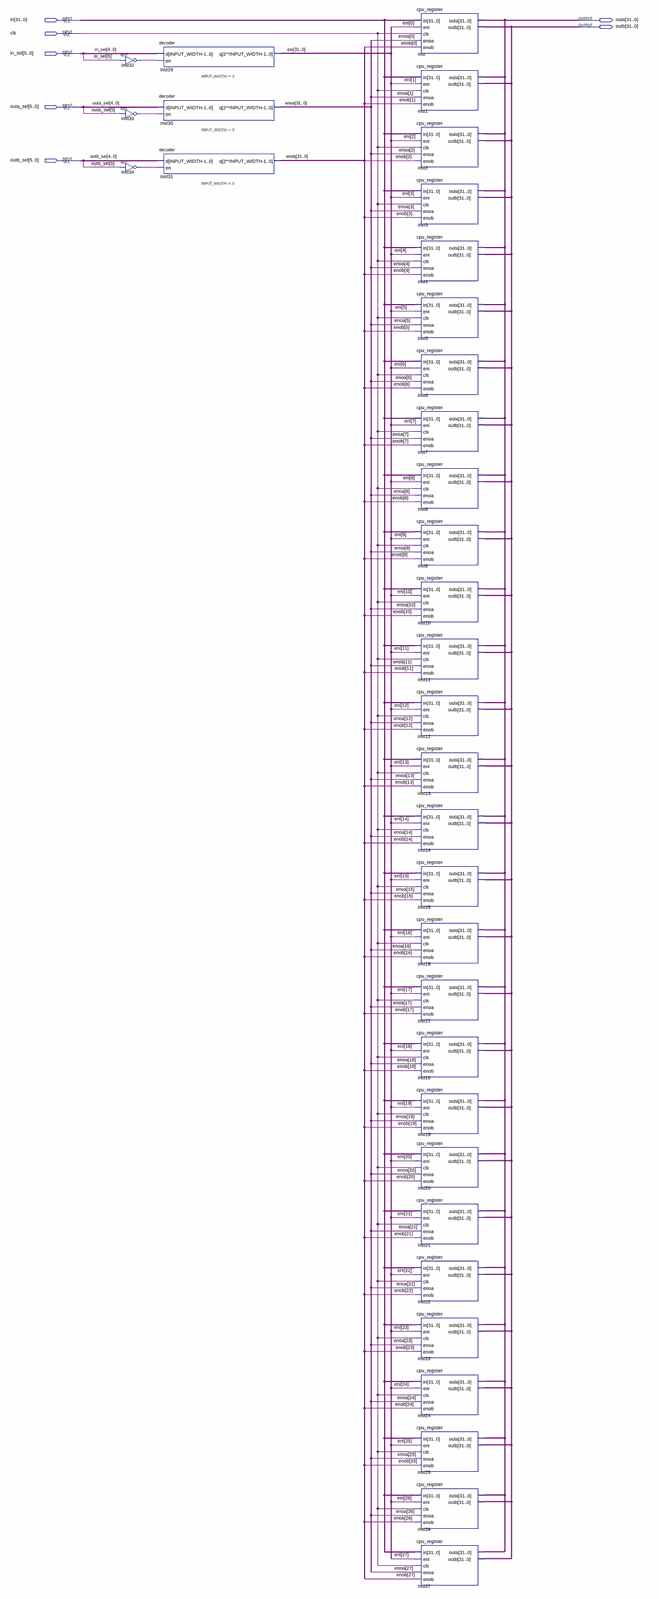
[diagram p0: schematic sheet, whole]
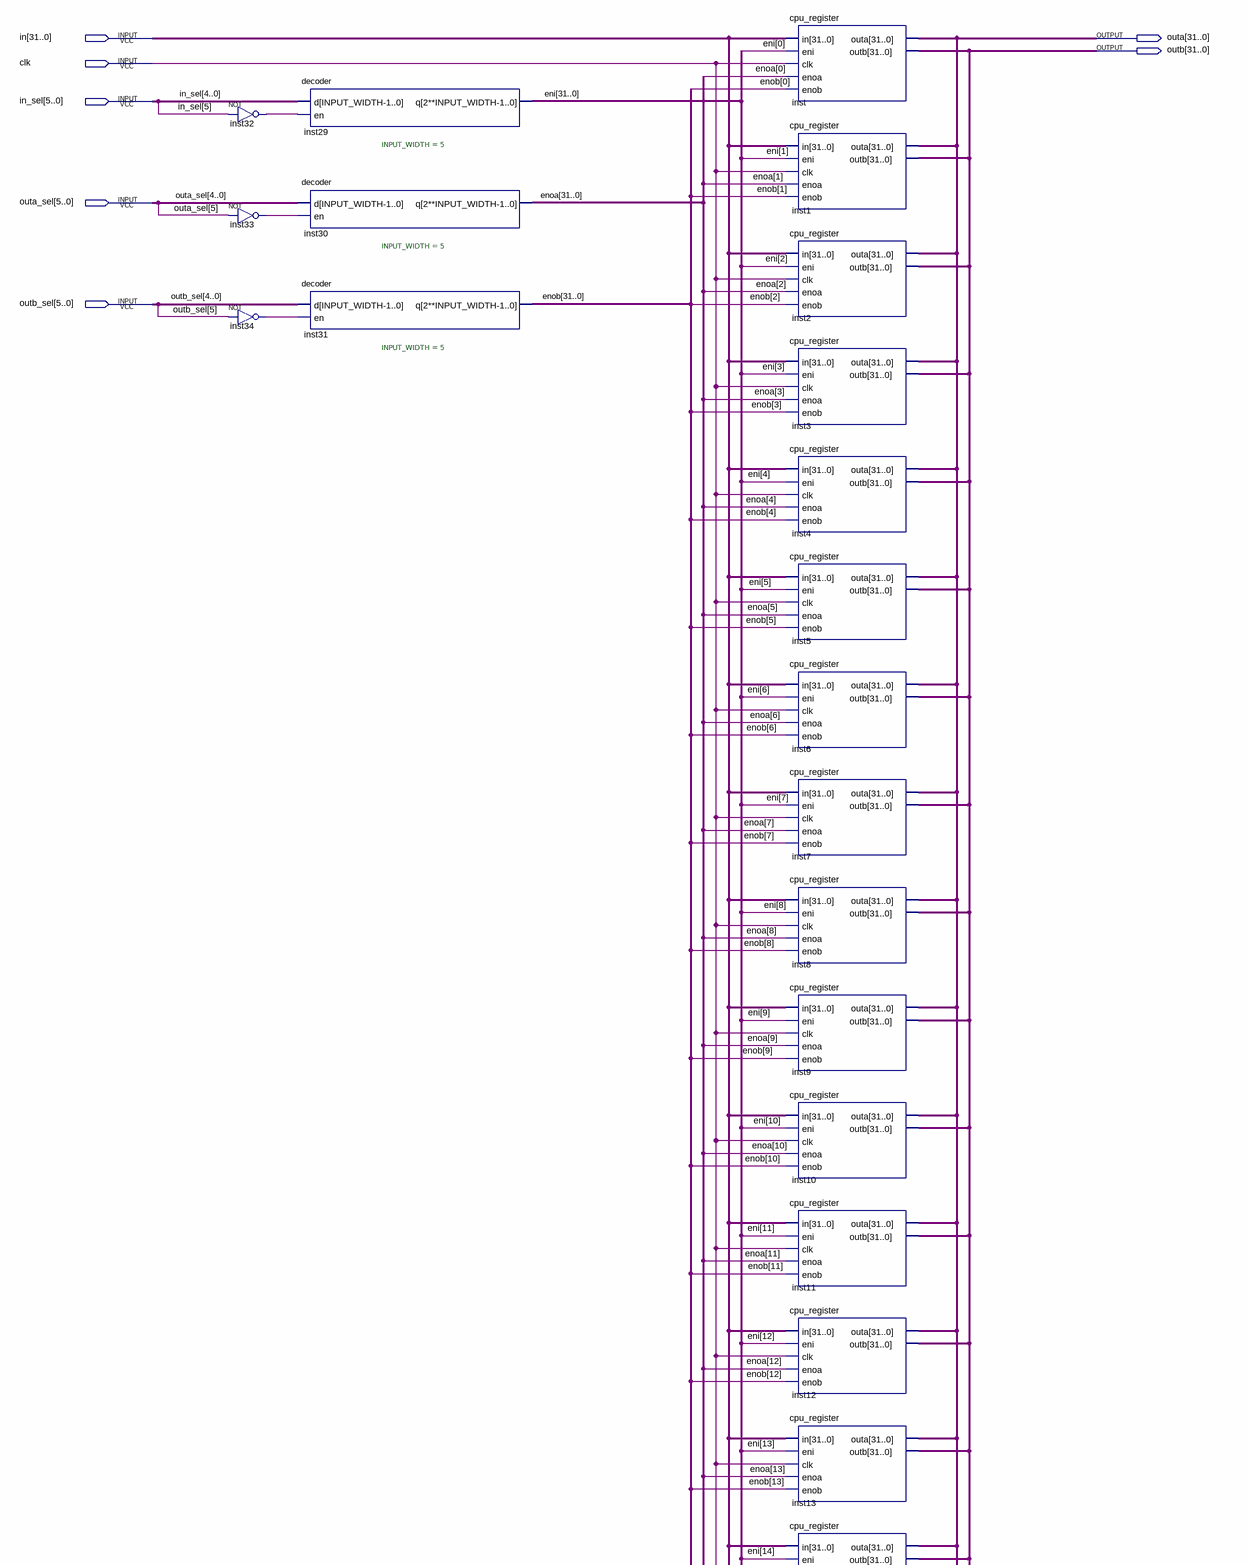
[diagram p1: schematic sheet, upper part]
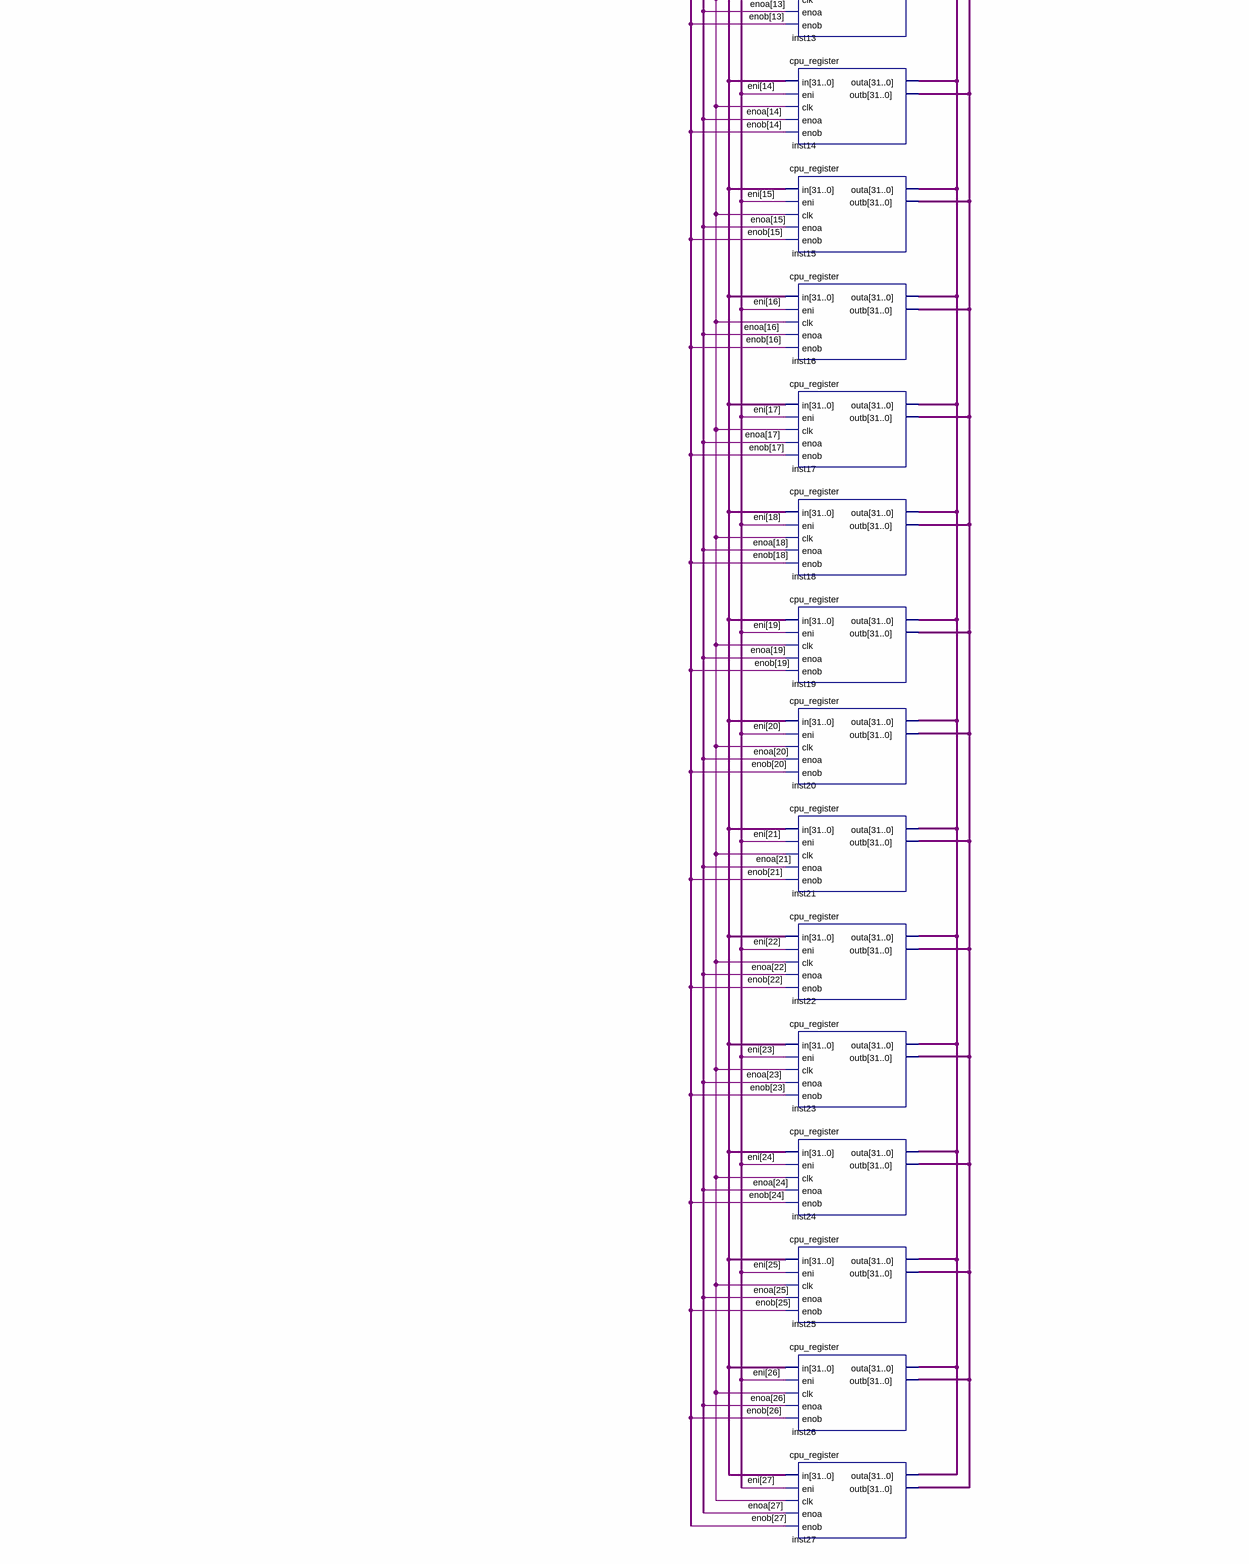
[diagram p2: schematic sheet, lower part]
// Quartus schematic general_register_bank.bdf as structural Verilog: 34 symbols, 7 pins
module general_register_bank (
  input  [31:0] in,
  input  clk,
  input  [5:0] in_sel,
  input  [5:0] outa_sel,
  input  [5:0] outb_sel,
  output [31:0] outa,
  output [31:0] outb
);

  wire inst32_out, inst33_out, inst34_out;
  wire [31:0] eni, enoa, enob;

  not inst32 (inst32_out, in_sel[5]);
  not inst33 (inst33_out, outa_sel[5]);
  not inst34 (inst34_out, outb_sel[5]);
  decoder #(.INPUT_WIDTH(5)) inst29 (.d(in_sel[4:0]), .en(inst32_out), .q(eni));
  decoder #(.INPUT_WIDTH(5)) inst30 (.d(outa_sel[4:0]), .en(inst33_out), .q(enoa));
  decoder #(.INPUT_WIDTH(5)) inst31 (.d(outb_sel[4:0]), .en(inst34_out), .q(enob));
  cpu_register inst (.in(in), .eni(eni[0]), .clk(clk), .enoa(enoa[0]), .enob(enob[0]), .outa(outa), .outb(outb));
  cpu_register inst1 (.in(in), .eni(eni[1]), .clk(clk), .enoa(enoa[1]), .enob(enob[1]), .outa(outa), .outb(outb));
  cpu_register inst2 (.in(in), .eni(eni[2]), .clk(clk), .enoa(enoa[2]), .enob(enob[2]), .outa(outa), .outb(outb));
  cpu_register inst3 (.in(in), .eni(eni[3]), .clk(clk), .enoa(enoa[3]), .enob(enob[3]), .outa(outa), .outb(outb));
  cpu_register inst4 (.in(in), .eni(eni[4]), .clk(clk), .enoa(enoa[4]), .enob(enob[4]), .outa(outa), .outb(outb));
  cpu_register inst5 (.in(in), .eni(eni[5]), .clk(clk), .enoa(enoa[5]), .enob(enob[5]), .outa(outa), .outb(outb));
  cpu_register inst6 (.in(in), .eni(eni[6]), .clk(clk), .enoa(enoa[6]), .enob(enob[6]), .outa(outa), .outb(outb));
  cpu_register inst7 (.in(in), .eni(eni[7]), .clk(clk), .enoa(enoa[7]), .enob(enob[7]), .outa(outa), .outb(outb));
  cpu_register inst8 (.in(in), .eni(eni[8]), .clk(clk), .enoa(enoa[8]), .enob(enob[8]), .outa(outa), .outb(outb));
  cpu_register inst9 (.in(in), .eni(eni[9]), .clk(clk), .enoa(enoa[9]), .enob(enob[9]), .outa(outa), .outb(outb));
  cpu_register inst10 (.in(in), .eni(eni[10]), .clk(clk), .enoa(enoa[10]), .enob(enob[10]), .outa(outa), .outb(outb));
  cpu_register inst11 (.in(in), .eni(eni[11]), .clk(clk), .enoa(enoa[11]), .enob(enob[11]), .outa(outa), .outb(outb));
  cpu_register inst12 (.in(in), .eni(eni[12]), .clk(clk), .enoa(enoa[12]), .enob(enob[12]), .outa(outa), .outb(outb));
  cpu_register inst13 (.in(in), .eni(eni[13]), .clk(clk), .enoa(enoa[13]), .enob(enob[13]), .outa(outa), .outb(outb));
  cpu_register inst14 (.in(in), .eni(eni[14]), .clk(clk), .enoa(enoa[14]), .enob(enob[14]), .outa(outa), .outb(outb));
  cpu_register inst15 (.in(in), .eni(eni[15]), .clk(clk), .enoa(enoa[15]), .enob(enob[15]), .outa(outa), .outb(outb));
  cpu_register inst16 (.in(in), .eni(eni[16]), .clk(clk), .enoa(enoa[16]), .enob(enob[16]), .outa(outa), .outb(outb));
  cpu_register inst17 (.in(in), .eni(eni[17]), .clk(clk), .enoa(enoa[17]), .enob(enob[17]), .outa(outa), .outb(outb));
  cpu_register inst18 (.in(in), .eni(eni[18]), .clk(clk), .enoa(enoa[18]), .enob(enob[18]), .outa(outa), .outb(outb));
  cpu_register inst19 (.in(in), .eni(eni[19]), .clk(clk), .enoa(enoa[19]), .enob(enob[19]), .outa(outa), .outb(outb));
  cpu_register inst20 (.in(in), .eni(eni[20]), .clk(clk), .enoa(enoa[20]), .enob(enob[20]), .outa(outa), .outb(outb));
  cpu_register inst21 (.in(in), .eni(eni[21]), .clk(clk), .enoa(enoa[21]), .enob(enob[21]), .outa(outa), .outb(outb));
  cpu_register inst22 (.in(in), .eni(eni[22]), .clk(clk), .enoa(enoa[22]), .enob(enob[22]), .outa(outa), .outb(outb));
  cpu_register inst23 (.in(in), .eni(eni[23]), .clk(clk), .enoa(enoa[23]), .enob(enob[23]), .outa(outa), .outb(outb));
  cpu_register inst24 (.in(in), .eni(eni[24]), .clk(clk), .enoa(enoa[24]), .enob(enob[24]), .outa(outa), .outb(outb));
  cpu_register inst25 (.in(in), .eni(eni[25]), .clk(clk), .enoa(enoa[25]), .enob(enob[25]), .outa(outa), .outb(outb));
  cpu_register inst26 (.in(in), .eni(eni[26]), .clk(clk), .enoa(enoa[26]), .enob(enob[26]), .outa(outa), .outb(outb));
  cpu_register inst27 (.in(in), .eni(eni[27]), .clk(clk), .enoa(enoa[27]), .enob(enob[27]), .outa(outa), .outb(outb));
endmodule
